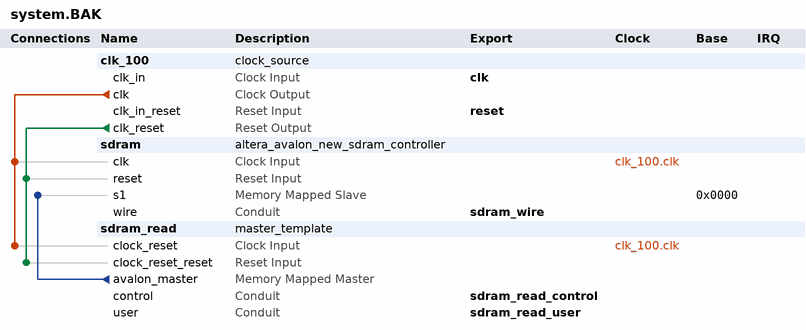
[diagram p0: system contents]
# Platform Designer (Qsys) system system.BAK, Cyclone IV E EP4CE22F17C6
# Parameters at their usual value, and those the tool derives, are not listed.
package require -exact qsys 15.1
create_system system.BAK
set_project_property DEVICE_FAMILY {Cyclone IV E}
set_project_property DEVICE EP4CE22F17C6

add_instance clk_100 clock_source 15.1
set_instance_parameter_value clk_100 clockFrequency 100000000

add_instance sdram altera_avalon_new_sdram_controller 15.1
set_instance_parameter_value sdram TAC 5.5
set_instance_parameter_value sdram TRCD 20.0
set_instance_parameter_value sdram TRP 20.0
set_instance_parameter_value sdram casLatency 3
set_instance_parameter_value sdram columnWidth 9
set_instance_parameter_value sdram dataWidth 16
set_instance_parameter_value sdram generateSimulationModel true
set_instance_parameter_value sdram model single_Micron_MT48LC4M32B2_7_chip
set_instance_parameter_value sdram numberOfBanks 4
set_instance_parameter_value sdram numberOfChipSelects 1
set_instance_parameter_value sdram powerUpDelay 100.0
set_instance_parameter_value sdram refreshPeriod 15.625
set_instance_parameter_value sdram rowWidth 13

add_instance sdram_read master_template 1.0
set_instance_parameter_value sdram_read ADDRESS_WIDTH 25
set_instance_parameter_value sdram_read BURST_CAPABLE 0
set_instance_parameter_value sdram_read DATA_WIDTH 16
set_instance_parameter_value sdram_read FIFO_DEPTH 8
set_instance_parameter_value sdram_read MASTER_DIRECTION 0
set_instance_parameter_value sdram_read MAXIMUM_BURST_COUNT 4
set_instance_parameter_value sdram_read MEMORY_BASED_FIFO 0

# connections
add_connection clk_100.clk sdram.clk clock
add_connection clk_100.clk sdram_read.clock_reset clock
add_connection clk_100.clk_reset sdram.reset reset
add_connection clk_100.clk_reset sdram_read.clock_reset_reset reset
add_connection sdram_read.avalon_master sdram.s1 avalon
set_connection_parameter_value sdram_read.avalon_master/sdram.s1 baseAddress 0x0000

# exported interfaces
add_interface clk clock sink
set_interface_property clk EXPORT_OF clk_100.clk_in
add_interface reset reset sink
set_interface_property reset EXPORT_OF clk_100.clk_in_reset
add_interface sdram_read_control conduit end
set_interface_property sdram_read_control EXPORT_OF sdram_read.control
add_interface sdram_read_user conduit end
set_interface_property sdram_read_user EXPORT_OF sdram_read.user
add_interface sdram_wire conduit end
set_interface_property sdram_wire EXPORT_OF sdram.wire

set_interconnect_requirement {$system} qsys_mm.clockCrossingAdapter HANDSHAKE
set_interconnect_requirement {$system} qsys_mm.enableEccProtection FALSE
set_interconnect_requirement {$system} qsys_mm.insertDefaultSlave FALSE
set_interconnect_requirement {$system} qsys_mm.maxAdditionalLatency 1

save_system system.BAK.qsys
